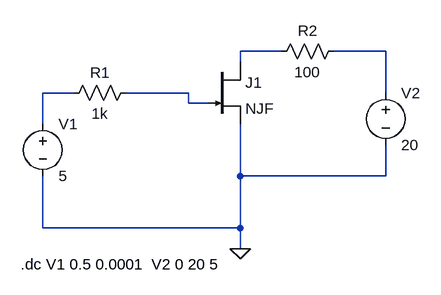
[diagram p0: schematic jfet1.asc]
jfet1.asc, the LTspice schematic file:
Version 4
SHEET 1 880 680
WIRE 320 32 256 32
WIRE 480 32 400 32
WIRE 256 48 256 32
WIRE 0 96 -48 96
WIRE 176 96 80 96
WIRE 480 96 480 32
WIRE 176 112 176 96
WIRE 208 112 176 112
WIRE -48 144 -48 96
WIRE 256 224 256 144
WIRE 480 224 480 176
WIRE 480 224 256 224
WIRE -48 304 -48 224
WIRE 256 304 256 224
WIRE 256 304 -48 304
WIRE 256 336 256 304
FLAG 256 336 0
SYMBOL voltage -48 128 R0
WINDOW 123 0 0 Left 0
WINDOW 39 0 0 Left 0
SYMATTR InstName V1
SYMATTR Value 5
SYMBOL voltage 480 80 R0
WINDOW 123 0 0 Left 0
WINDOW 39 0 0 Left 0
SYMATTR InstName V2
SYMATTR Value 20
SYMBOL res 96 80 R90
WINDOW 0 0 56 VBottom 2
WINDOW 3 32 56 VTop 2
SYMATTR InstName R1
SYMATTR Value 1k
SYMBOL res 416 16 R90
WINDOW 0 0 56 VBottom 2
WINDOW 3 32 56 VTop 2
SYMATTR InstName R2
SYMATTR Value 100
SYMBOL njf 208 48 R0
SYMATTR InstName J1
TEXT -82 360 Left 2 !.dc V1 0.5 0.0001  V2 0 20 5

The netlist it stands for:
* jfet1.asc
V1 N003 0 5
V2 N002 0 20
R1 N004 N003 1k
R2 N002 N001 100
J1 N001 N004 0 NJF
.model NJF NJF
.model PJF PJF
.lib standard.jft
.dc V1 0.5 0.0001  V2 0 20 5
.backanno
.end